# EasyEDA schematic esp32_display_schema.json
TITLE: esp32_display; REV: 1.0; Date: 2025-03-12; Sheet: 1/1; Company: Filippo Raciti
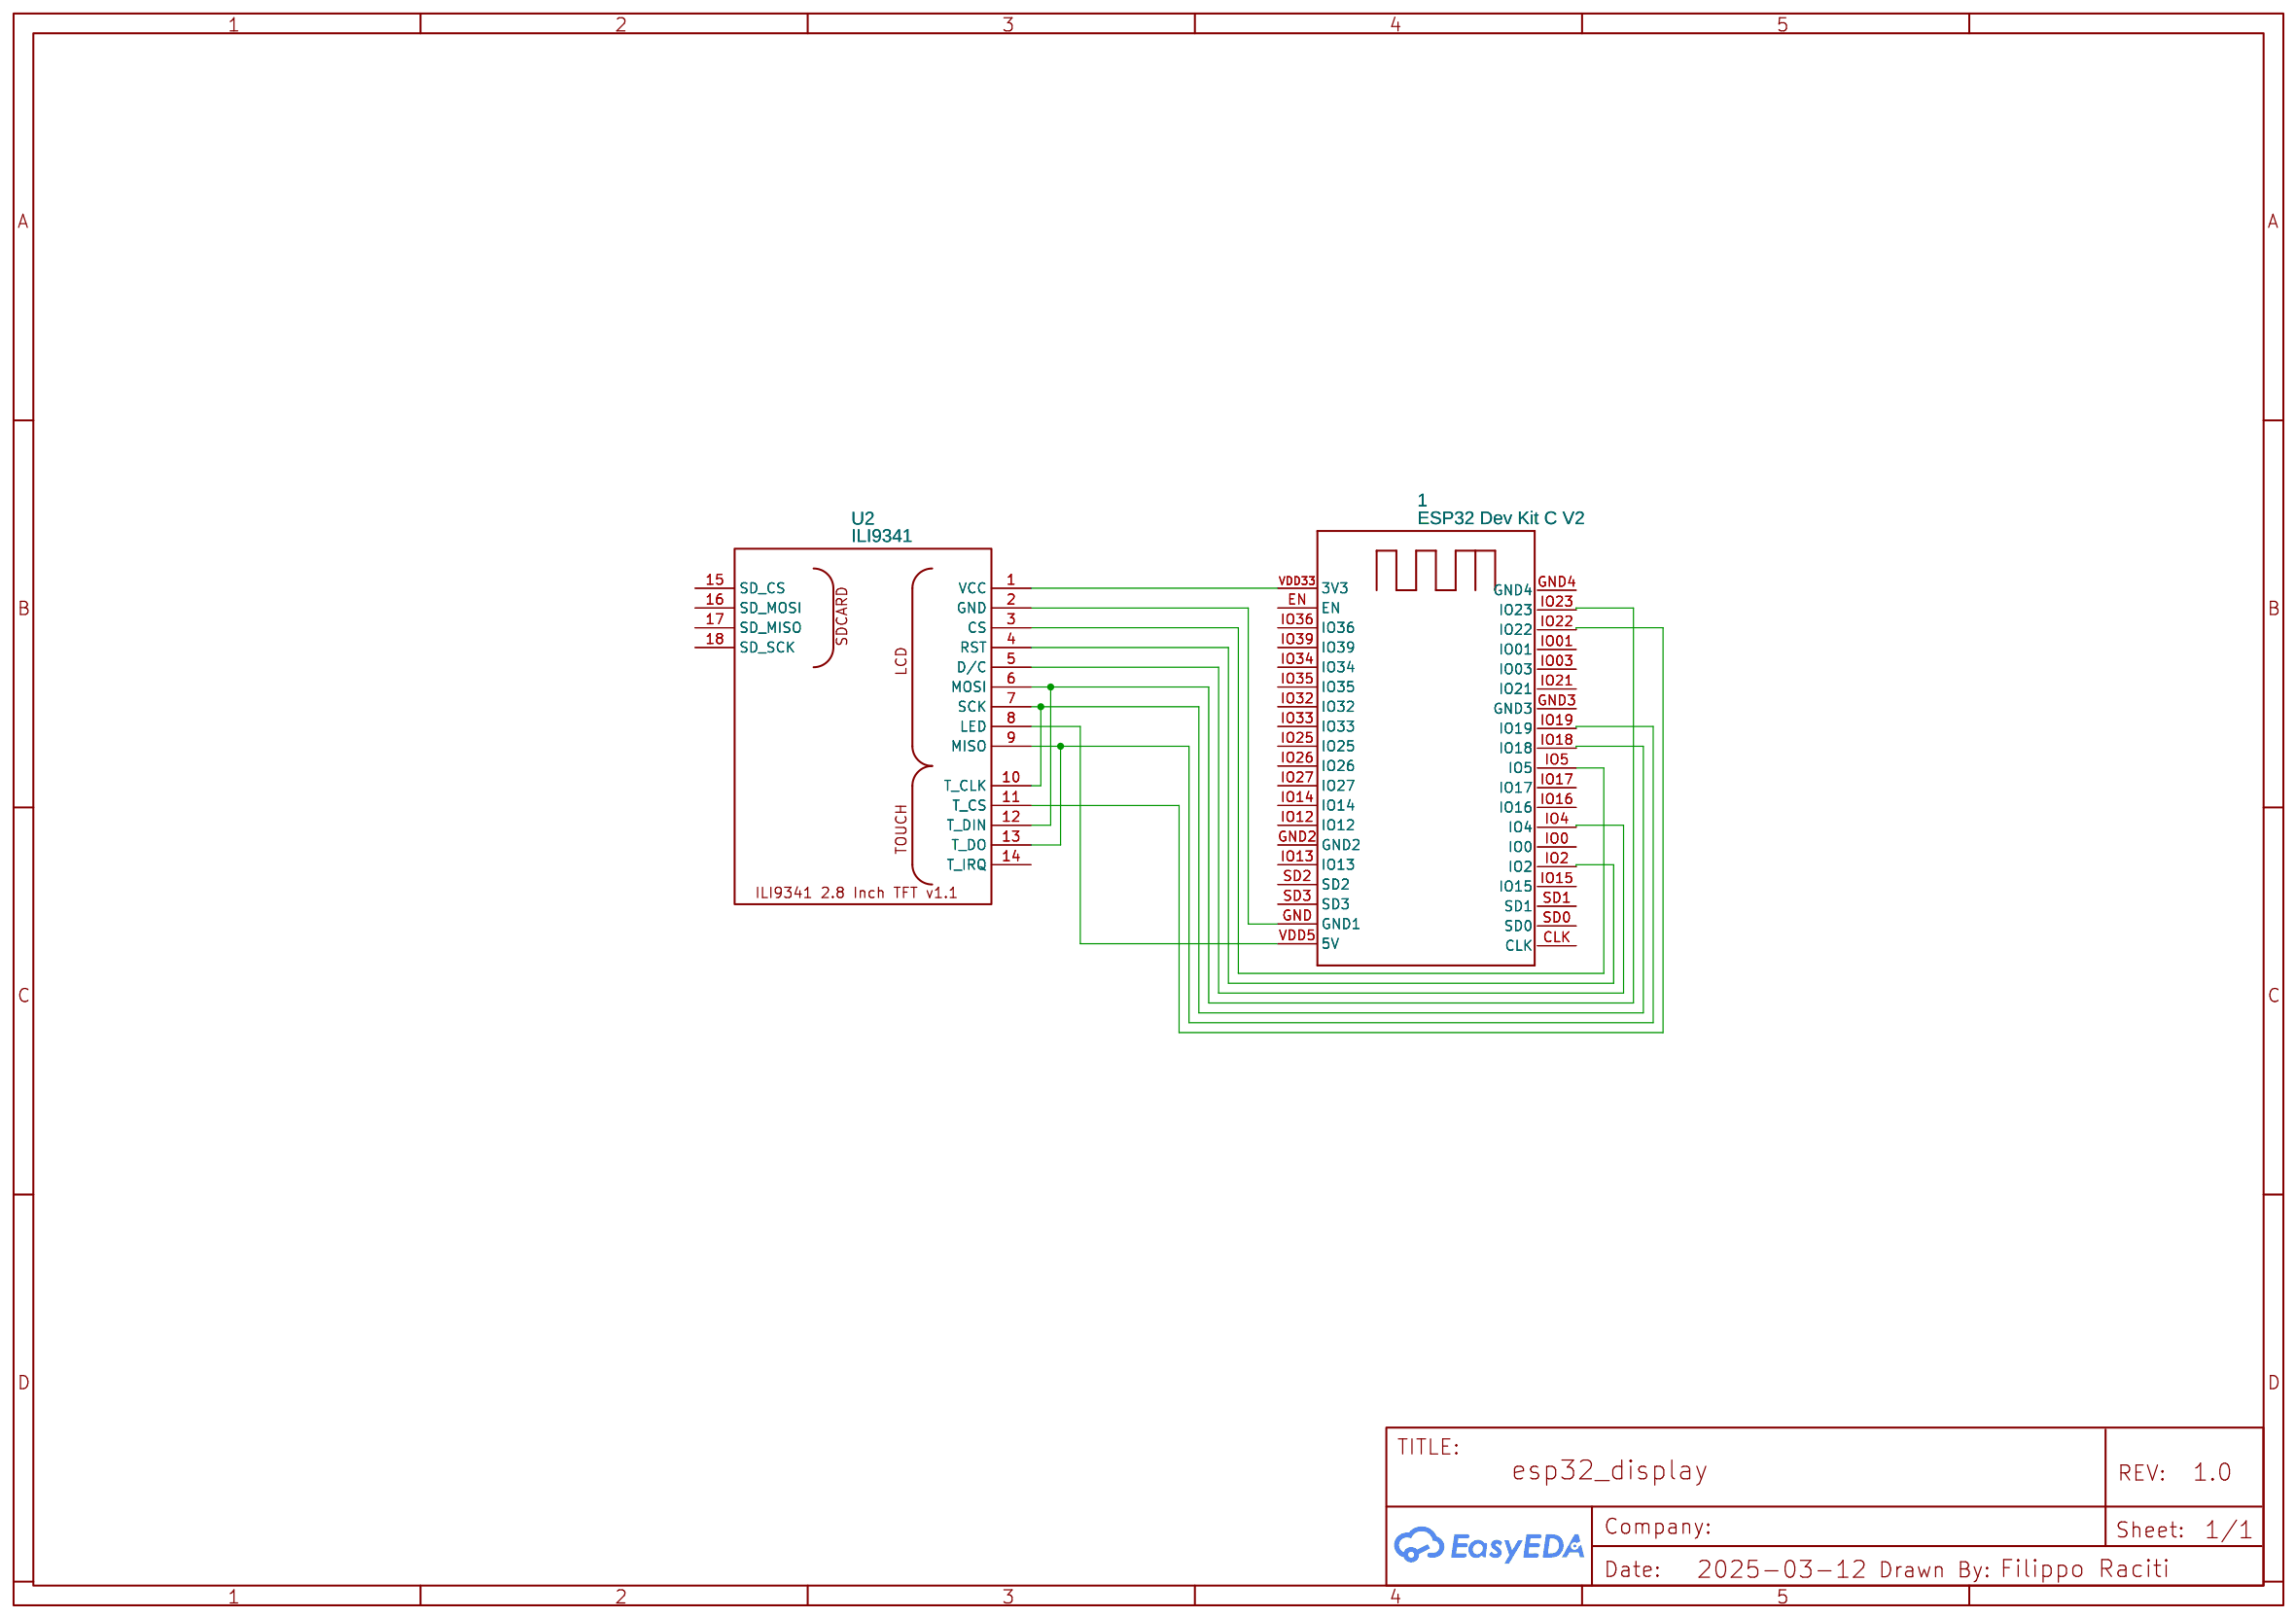
[diagram p0: schematic sheet]

## Parts
1  ESP32 Dev Kit C V2  [ESP32-WROVER_ESP32-WROVER]
U2  ILI9341  [ILI9341-2.8]

## Library data of the parts
1 = ESP32 Dev Kit C V2: Contributor: cesargarciagames
U2 = ILI9341: Contributor: Max

## Nets
Net-(1-GND): 1.GND(GND1) U2.2(GND)
Net-(1-IO2): 1.IO2 U2.4(RST)
Net-(1-IO4): 1.IO4 U2.5(D/C)
Net-(1-IO5): 1.IO5 U2.3(CS)
Net-(1-IO18): 1.IO18 U2.7(SCK) U2.10(T_CLK)
Net-(1-IO19): 1.IO19 U2.9(MISO) U2.13(T_DO)
Net-(1-IO22): 1.IO22 U2.11(T_CS)
Net-(1-IO23): 1.IO23 U2.6(MOSI) U2.12(T_DIN)
Net-(1-VDD5): 1.VDD5(5V) U2.8(LED)
Net-(1-VDD33): 1.VDD33(3V3) U2.1(VCC)

Not connected (* = marked no-connect by the designer): 1 CLK EN GND2 GND3 GND4 IO0 IO01 IO03 IO12 IO13 IO14 IO15 IO16 IO17 IO21 IO25 IO26 IO27 IO32 IO33 IO34 IO35 IO36 IO39 SD0 SD1 SD2 SD3; U2 14(T_IRQ) 15(SD_CS) 16(SD_MOSI) 17(SD_MISO) 18(SD_SCK)
